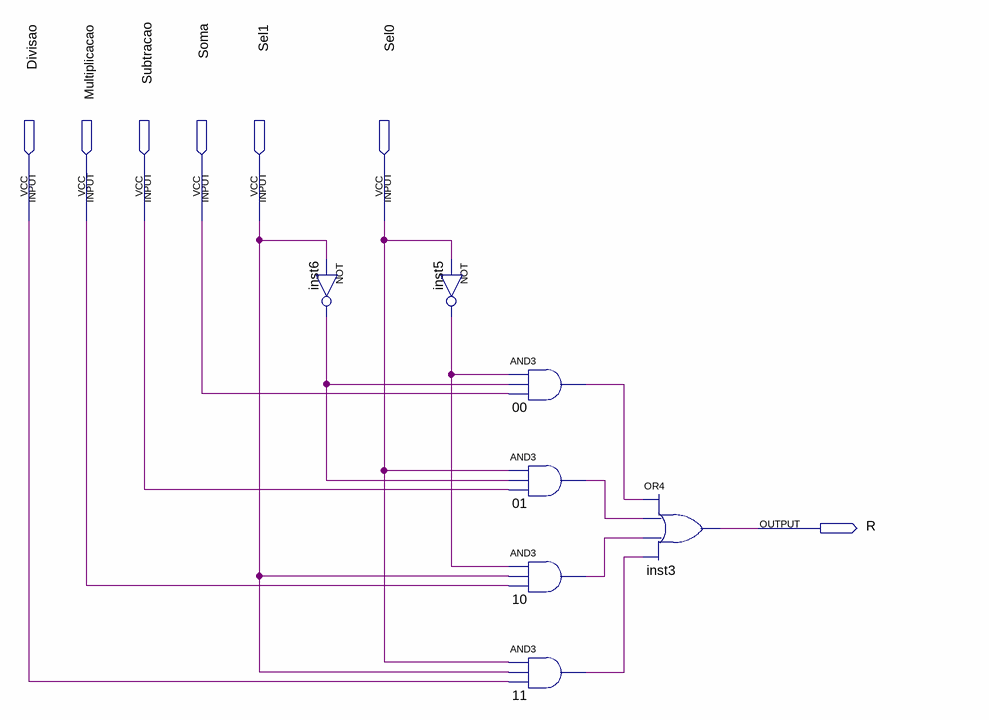
[diagram p0: schematic sheet]
// Quartus schematic MuxSeletor2bits.bdf as structural Verilog: 7 symbols, 7 pins
module MuxSeletor2bits (
  input  Divisao,
  input  Multiplicacao,
  input  Subtracao,
  input  Soma,
  input  Sel1,
  input  Sel0,
  output R
);

  wire inst5_out, inst6_out, n00_out, n01_out, n10_out, n11_out;

  not inst6 (inst6_out, Sel1);
  not inst5 (inst5_out, Sel0);
  and u_00 (n00_out, inst5_out, inst6_out, Soma);
  and u_01 (n01_out, Sel0, inst6_out, Subtracao);
  and u_10 (n10_out, inst5_out, Sel1, Multiplicacao);
  and u_11 (n11_out, Sel0, Sel1, Divisao);
  or inst3 (R, n00_out, n01_out, n10_out, n11_out);
endmodule
